# EAGLE design Buck_SMPS_Rev2_2022_05_26_A (EAGLE 9.6.1)
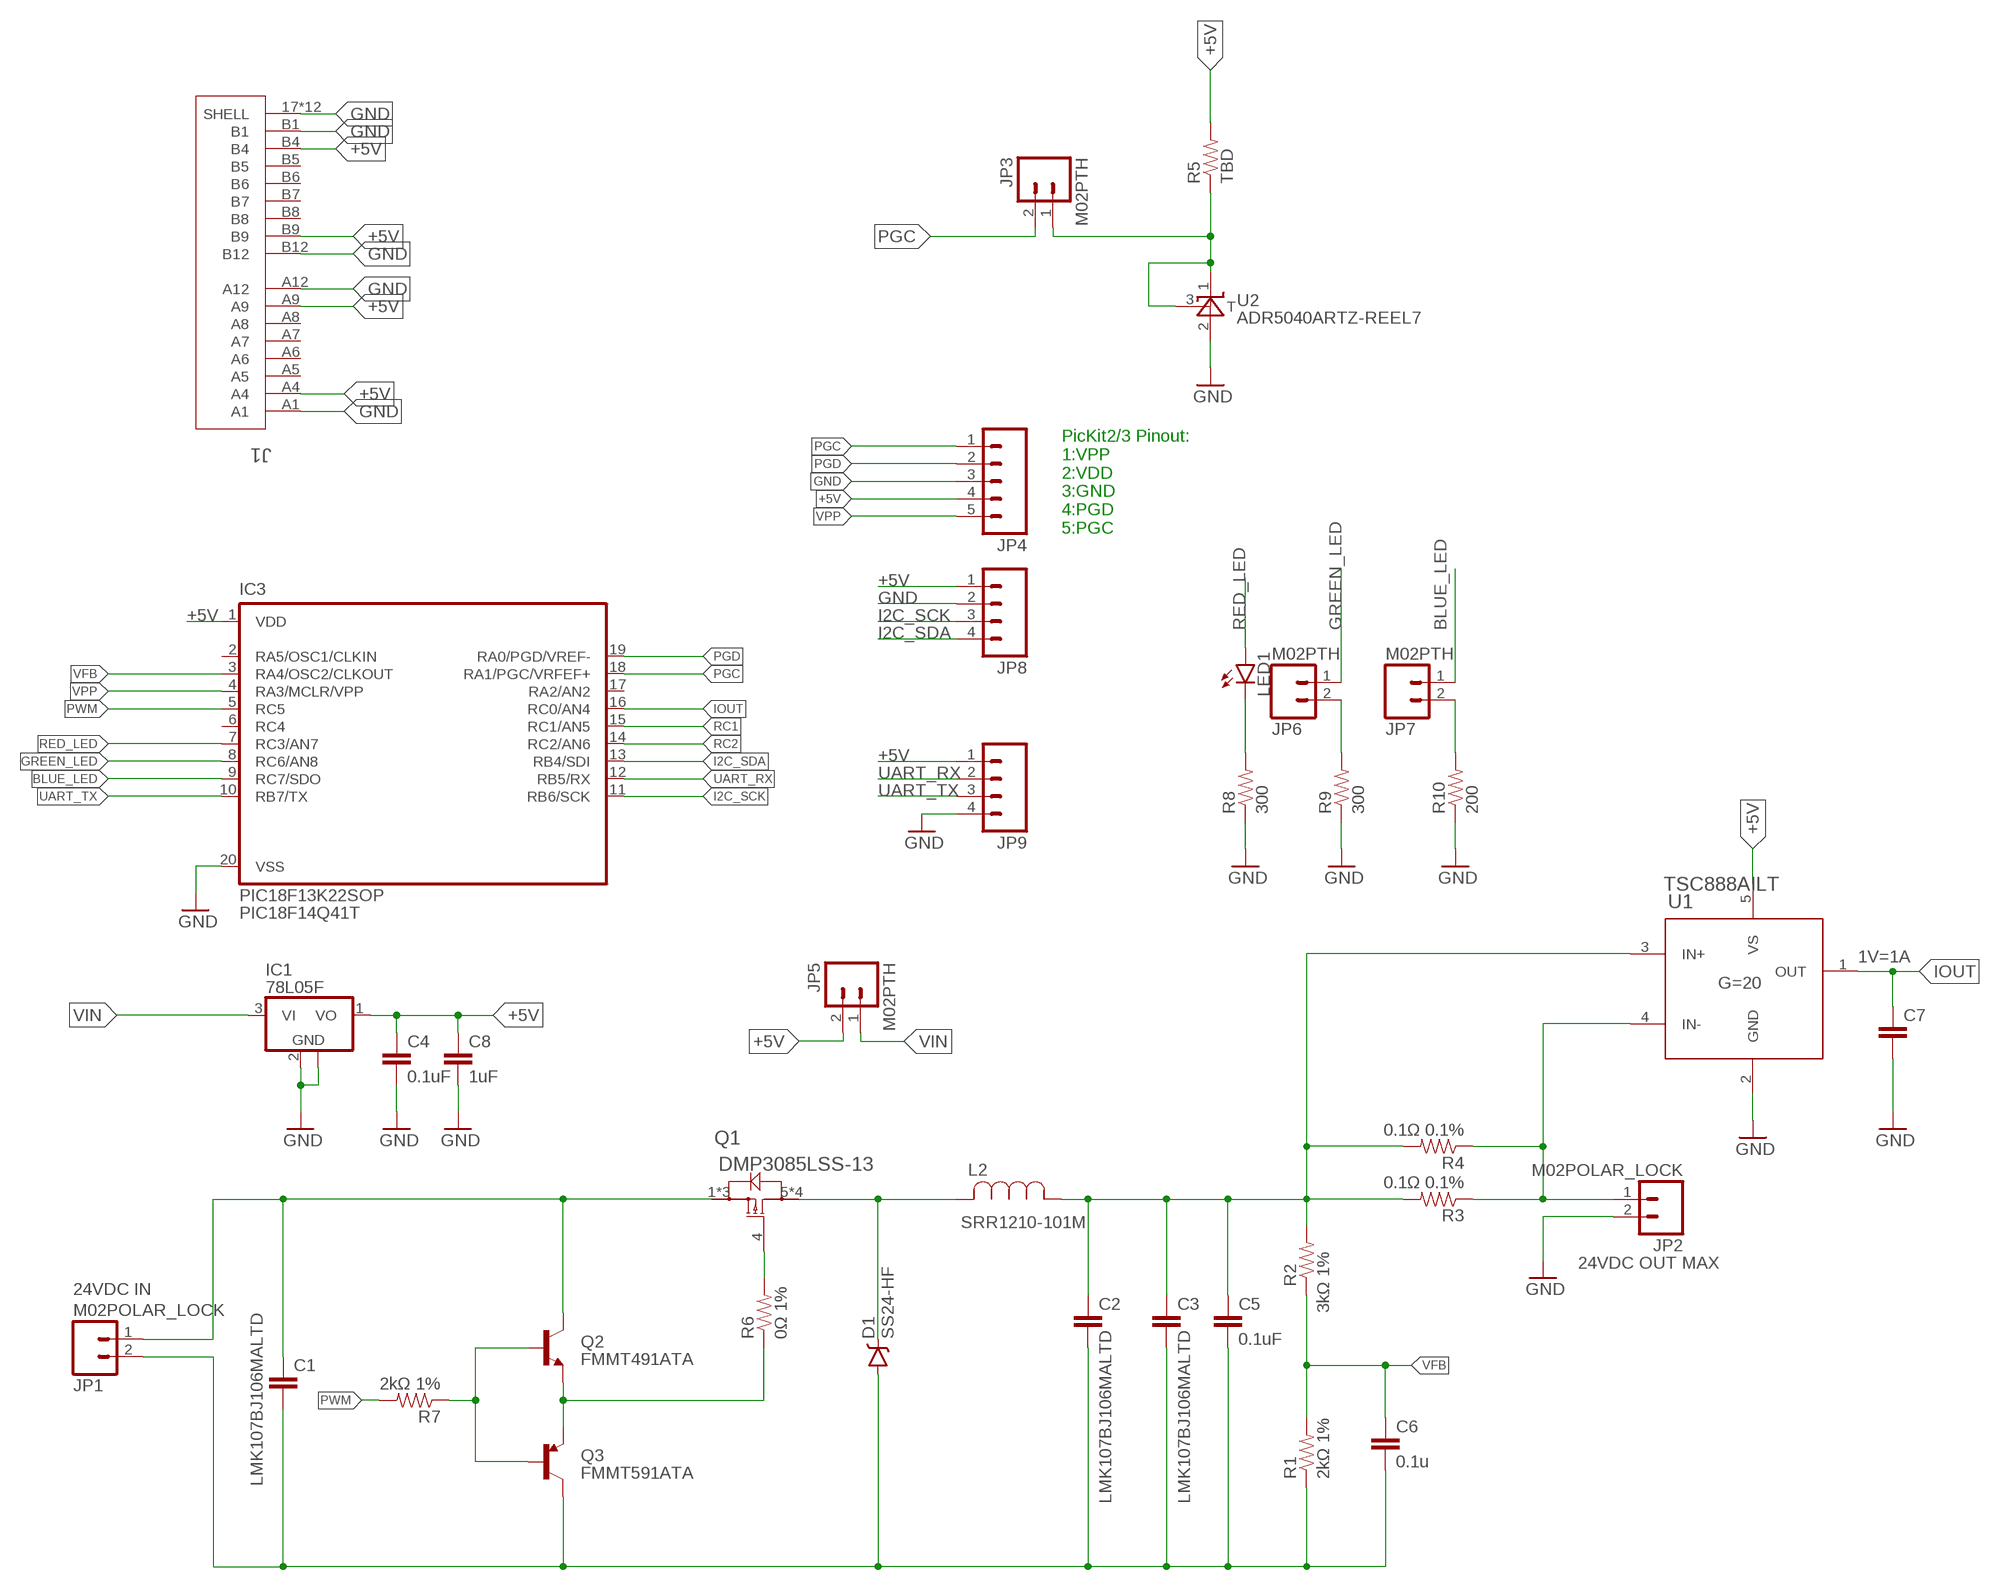
[diagram p0: schematic, sheet 1]

## Parts
C1  LMK107BJ106MALTD  CAP1206  [1206]
C2  LMK107BJ106MALTD  CAP1206  [1206]
C3  LMK107BJ106MALTD  CAP1206  [1206]
C4  0.1uF  CAP1206  [1206]
C5  0.1uF  CAP1206  [1206]
C6  0.1u  CAP0805  [0805]
C7  CAP0805  [0805]
C8  1uF  CAP1206  [1206]
D1  SS24-HF  DIODE-SCHOTTKY-MBRA140  [SMA-DIODE]
IC1  78L05F  [SOT89]
IC3  PIC18F13K22SOP  [SOP20W]
J1  USB4085-GF-A  [CONN16_USB4085-GF-A_GCT]
JP1  M02POLAR_LOCK  [MOLEX-1X2_LOCK]
JP2  M02POLAR_LOCK  [MOLEX-1X2_LOCK]
JP3  M02PTH  [1X02]
JP4  M05PTH_LONGPADS  [1X05_LONGPADS]
JP5  M02PTH  [1X02]
JP6  M02PTH  [1X02]
JP7  M02PTH  [1X02]
JP8  M04LOCK  [1X04_LOCK]
JP9  M04LOCK  [1X04_LOCK]
L2  SRR1210-101M  SRR1210-680M  [IND_BOURNS_SRR1210]
LED1  LED1206  [LED-1206]
Q1  DMP3085LSS-13  DMP3085LSS-13IC_DMP3085LSS-13_DIO-M  [IC_DMP3085LSS-13_DIO-M]
Q2  FMMT491ATA  TRANSISTOR_NPNMMBT5088  [SOT23]
Q3  FMMT591ATA  TRANSISTOR_PNPMMBT4403  [SOT23]
R1  2kΩ 1%  RESISTOR1206  [1206]
R2  3kΩ 1%  RESISTOR1206  [1206]
R3  0.1Ω 0.1%  RESISTOR1206  [1206]
R4  0.1Ω 0.1%  RESISTOR1206  [1206]
R5  TBD  RESISTOR1206  [1206]
R6  0Ω 1%  RESISTOR1206  [1206]
R7  2kΩ 1%  RESISTOR1206  [1206]
R8  300  RESISTOR1206  [1206]
R9  300  RESISTOR1206  [1206]
R10  200  RESISTOR1206  [1206]
U1  TSC888AILT  INA180A1IDBVR  [DBV0005A_N]
U2  ADR5040ARTZ-REEL7  [RT_3_ADI]

## Nets
+5V: C4.1 C8.1 IC1.1(VO) IC3.1(VDD) J1.A4 J1.A9 J1.B4 J1.B9 JP4.4 JP5.2 JP8.1 JP9.1 R5.2 U1.5(VS)
BLUE_LED: IC3.9(RC7/SDO) JP7.1
GND: C1.2 C2.2 C3.2 C4.2 C5.2 C6.2 C7.2 C8.2 D1.A IC1.2(GND) IC1.2@1(GND) IC3.20(VSS) J1.17(SHELL) J1.18(SHELL) J1.19(SHELL) J1.20(SHELL) J1.21(SHELL) J1.22(SHELL) J1.23(SHELL) J1.24(SHELL) J1.25(SHELL) J1.26(SHELL) J1.27(SHELL) J1.28(SHELL) J1.A1 J1.A12 J1.B1 J1.B12 JP1.2 JP2.2 JP4.3 JP8.2 JP9.4 Q3.3(C) R1.1 R8.1 R9.1 R10.1 U1.2(GND) U2.2(A)
GREEN_LED: IC3.8(RC6/AN8) JP6.1
I2C_SCK: IC3.11(RB6/SCK) JP8.3
I2C_SDA: IC3.13(RB4/SDI) JP8.4
IOUT: C7.1 IC3.16(RC0/AN4) U1.1(OUT)
N$3: LED1.C R8.2
N$5: Q2.2(E) Q3.2(E) R6.1
N$6: JP6.2 R9.2
N$7: JP7.2 R10.2
N$8: Q1.4(G) R6.2
N$9: Q2.1(B) Q3.1(B) R7.1
PGC: IC3.18(RA1/PGC/VRFEF+) JP3.2 JP4.1
PGD: IC3.19(RA0/PGD/VREF-) JP4.2
PWM: IC3.5(RC5) R7.2
RC1: IC3.15(RC1/AN5)
RC2: IC3.14(RC2/AN6)
RED_LED: IC3.7(RC3/AN7) LED1.A
SW: D1.C L2.2 Q1.5(D) Q1.6(D) Q1.7(D) Q1.8(D)
UART_RX: IC3.12(RB5/RX) JP9.2
UART_TX: IC3.10(RB7/TX) JP9.3
VFB: C6.1 IC3.3(RA4/OSC2/CLKOUT) R1.2 R2.1
VIN: C1.1 IC1.3(VI) JP1.1 JP5.1 Q1.1(S) Q1.2(S) Q1.3(S) Q2.3(C)
VOUT: C2.1 C3.1 C5.1 L2.1 R2.2 R3.2 R4.2 U1.3(IN+)
VOUT+: JP2.1 R3.1 R4.1 U1.4(IN-)
VPP: IC3.4(RA3/MCLR/VPP) JP4.5
VREF+: JP3.1 R5.1 U2.1(C) U2.3(T)
Unconnected: IC3.2(RA5/OSC1/CLKIN) IC3.6(RC4) IC3.17(RA2/AN2) J1.A5 J1.A6 J1.A7 J1.A8 J1.B5 J1.B6 J1.B7 J1.B8

## Notes on the sheet
- PicKit2/3 Pinout:
  1:VPP
  2:VDD
  3:GND
  4:PGD
  5:PGC
- PIC18F14Q41T
- 1V=1A
- G=20
- 24VDC OUT MAX
- 24VDC IN

## Library data of the parts
C1-C8 = SparkFun-Capacitors:CAP: Capacitor Standard 0603 ceramic capacitor, and 0.1" leaded capacitor.
D1 = SparkFun-DiscreteSemi:DIODE-SCHOTTKY: Schottky diodes in SFE's production catalog BAT20J 1A 23V 0.62Vf RB751 120mA 40V 0.37Vf PMEG4005EJ 0.5A 40V 0.42Vf MBRA140 1A 40V 0.5Vf B340A 3A 40V SMA; PROD_ID: DIO-08053; VALUE: MBRA140
IC1 = linear:78L*: POSITOIV-VOLTAGE REGULATORS Output up to 100 mA Source: Datasheet <http://focus.ti.com/lit/ds/symlink/ua78l05.pdf>
IC3 = PIC18F13k22:PIC18F13K22?: 18/20/28-Pin High-Performance, Enhanced Flash Microcontrollers with 10-bit A/D and nanoWatt Technology Source: ww1.microchip.com/downloads/en/DeviceDoc/39605c.pdf
J1 = USB4085-GF-A_USB_C:USB4085-GF-A; COPYRIGHT: Copyright (C) 2022 Ultra Librarian. All rights reserved.; DIGI-KEY_PART_NUMBER_1: 2073-USB4085-GF-ACT-ND; DIGI-KEY_PART_NUMBER_2: 2073-USB4085-GF-ADKR-ND; DIGI-KEY_PART_NUMBER_3: 2073-USB4085-GF-ATR-ND; MANUFACTURER_PART_NUMBER: USB4085-GF-A; MFR_NAME: Global Connector Technology
JP1-JP3 JP5-JP7 = SparkFun-Connectors:M02: Standard 2-pin 0.1" header. Use with - straight break away headers ( PRT-00116) - right angle break away headers (PRT-00553) - swiss pins (PRT-00743) - machine pins (PRT-00117) - female headers (PRT-00115) Molex polarized connector foot print use with: PRT-08233 with associated crimp pins and housings. 2.54_SCREWTERM for use with PRT-10571. 3.5mm Screw Terminal footprints for PRT-08084 5mm Screw Terminal footprints for use with PRT-08432
JP4 = SparkFun-Connectors:M05: Header 5 Standard 5-pin 0.1" header. Use with straight break away headers (SKU : PRT-00116), right angle break away headers (PRT-00553), swiss pins (PRT-00743), machine pins (PRT-00117), and female headers (PRT-00115). Molex polarized connector foot print use with SKU : PRT-08230 with associated crimp pins and housings.
JP8 JP9 = SparkFun-Connectors:M04: Header 4 Standard 4-pin 0.1" header. Use with straight break away headers (SKU : PRT-00116), right angle break away headers (PRT-00553), swiss pins (PRT-00743), machine pins (PRT-00117), and female headers (PRT-00115). Molex polarized connector foot print use with SKU : PRT-08231 with associated crimp pins and housings. 1MM SMD Version SKU: PRT-10208
L2 = SRR1210_XXX:SRR1210-680M; MANUFACTURER_PART_NUMBER: SRR1210680M; VENDOR: Bourns Electronics
LED1 = SparkFun-LED:LED: LEDs Standard schematic elements and footprints for 5mm, 3mm, 1206, and 0603 sized LEDs. 5mm - Spark Fun Electronics SKU : COM-00529 (and others)
Q1 = DMP3085LSS-13:DMP3085LSS-13; COPYRIGHT: Copyright (C) 2021 Ultra Librarian. All rights reserved.; DIGI-KEY_PART_NUMBER_1: DMP3085LSS-13DITR-ND; DIGI-KEY_PART_NUMBER_2: DMP3085LSS-13DICT-ND; DIGI-KEY_PART_NUMBER_3: DMP3085LSS-13DIDKR-ND; MANUFACTURER_PART_NUMBER: DMP3085LSS-13; MFR_NAME: Diodes Inc
Q2 = SparkFun-DiscreteSemi:TRANSISTOR_NPN: Generic NPN BJT MMBT2222A - TRANS-08049 (SOT-23, 1A 40V) MPSA42 - TRANS-09116 (SOT-23, 500mA 300V) MMBT5088LT1G - TRANS-11160 (SOT-23, 50 mA 30V) BC547 - COM-08928 <http://www.sparkfun.com/products/8928> (TO-92 45V 100mA) (1.Collector 2.Base 3.Emitter) 2N3904 - COM-00521 <http://www.sparkfun.com/products/521> (TO-92 40V 200mA) (1.Emitter 2.Base 3.Collector) P2N2222A - COM-12852 <http://www.sparkfun.com/products/12852> (TO-92 40V 600mA) (1.Collector 2.Base 3.Emitter); PROD_ID: TRANS-11160; VALUE: MMBT5088
Q3 = SparkFun-DiscreteSemi:TRANSISTOR_PNP: Generic PNP BJT Double check pinouts against datasheets- not all devices are the same! MMBT3906 - 40V 200mA SOT-23 (TRANS-08052) MMBT4403 - 40V 600mA SOT-23 (TRANS-09245); PROD_ID: TRANS-09245; VALUE: MMBT4403
R1-R10 = SparkFun-Passives:RESISTOR: Resistor Basic schematic elements and footprints for 0603, 1206, and PTH resistors.
U1 = INA180A1IDBVR:INA180A1IDBVR; MANUFACTURER: Texas Instruments; PARTNUMBER: INA180A1IDBVR; REFDES: RefDes; TYPE: TYPE; VALUE: Value
U2 = ADR5040ARTZ:ADR5040ARTZ-REEL7; BUILT_BY: EMA_UL_Team; MANUFACTURER_PART_NUMBER: ADR5040ARTZ-REEL7; SOURCELIBRARY: Analog_2015-01-06; VENDOR: Analog Devices Inc

## Board
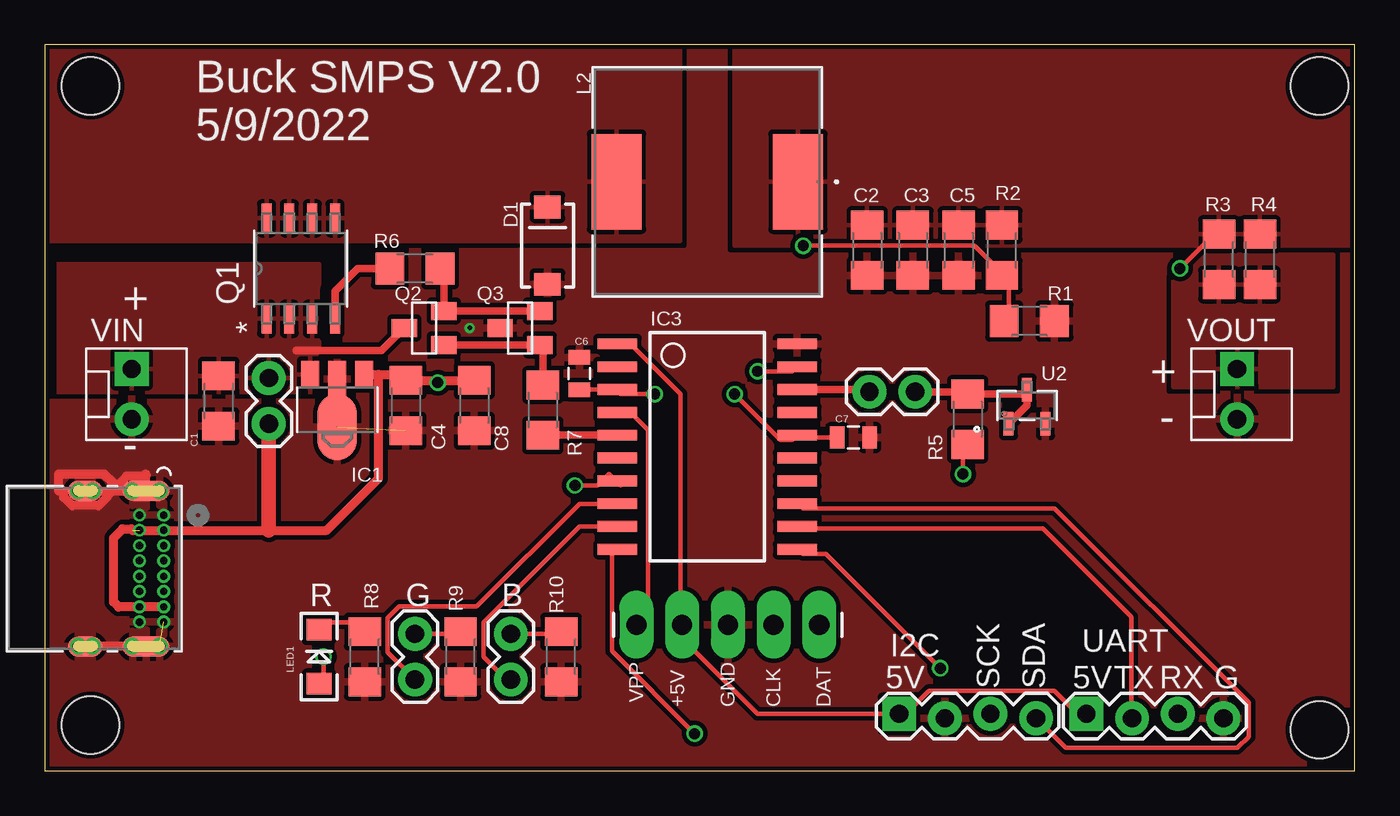
[diagram p1: board, top side]
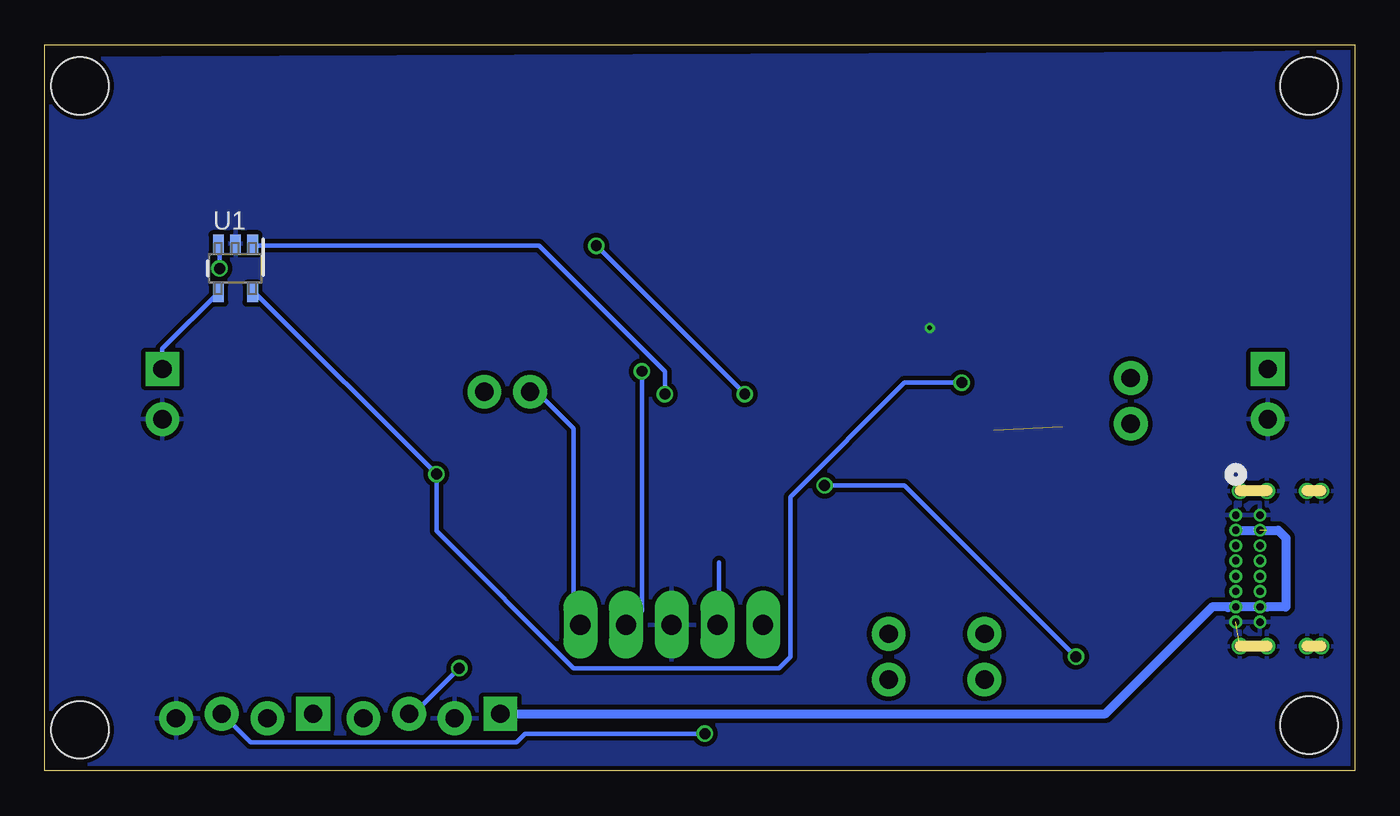
[diagram p2: board, bottom side, seen from below]

Size 72.82 x 40.38 mm. Coordinates in mm from the lower left corner, seen from the top.
Outline: 0,0 72.82,0 72.82,40.38 0,40.38 0,0
Copper layers (1*16): Top 0.035mm / dielectric 1.5mm / Bottom 0.035mm
Design rules "default": minimum track width 5mil, minimum drill 5mil, track to track 10mil, track to pad 10mil, pad to pad 10mil, via to via 10mil, smd to smd 6mil, copper to edge 10mil, drill to drill 6mil, minimum pad ring 6mil, minimum via ring 6mil, stop-mask expansion 4mil, vias tented up to drill 0mil, thermal gap 10mil
Holes 3.2 mm at 2.54,38.1 2.54,2.54 70.87,2.29 70.87,38.1

### Footprints (pad centres in the part's own frame; a part is rotated, then mirrored left to right if it is on the bottom)
1206 = smd 1.6 x 1.8: 1 -1.4,0; 2 1.4,0
0805 = smd 0.8 x 1.2: 1 -0.9,0; 2 0.9,0
SMA-DIODE = smd 1.27 x 1.47: A -2.15,0; C 2.15,0
SOT89 = smd 1 x 1.5: 1 -1.499,-1.981; 3 1.499,-1.981 | smd 1 x 2: 2 0,-1.727 | smd 2.2 x 3.7: 2@1 0,0.94
SOP20W = smd 0.6 x 2.2: 1 -5.715,-5; 2 -4.445,-5; 3 -3.175,-5; 4 -1.905,-5; 5 -0.635,-5; 6 0.635,-5; 7 1.905,-5; 8 3.175,-5; 9 4.445,-5; 10 5.715,-5; 11 5.715,5; 12 4.445,5; 13 3.175,5; 14 1.905,5; 15 0.635,5; 16 -0.635,5; 17 -1.905,5; 18 -3.175,5; 19 -4.445,5; 20 -5.715,5
CONN16_USB4085-GF-A_GCT = smd 1.118 x 2.616: 17 -1.35,-0.98; 18 7.3,-0.98 | smd 1.118 x 1.905: 19 -1.35,-4.365; 20 7.3,-4.365 | drill 0.61 pad 0.61: 21 -1.346,-0.229; 22 -1.346,-1.727; 23 7.29,-0.229; 24 7.29,-1.727; 25 -1.346,-3.962; 26 -1.346,-4.75; 27 7.29,-3.962; 28 7.29,-4.75 | drill 0.406 pad 0.66: A1 0,0; A4 0.838,0; A5 1.702,0; A6 2.54,0; A7 3.404,0; A8 4.242,0; A9 5.105,0; A12 5.944,0; B1 5.944,-1.346; B4 5.105,-1.346; B5 4.242,-1.346; B6 3.404,-1.346; B7 2.54,-1.346; B8 1.702,-1.346; B9 0.838,-1.346; B12 0,-1.346
MOLEX-1X2_LOCK = drill 1.016 pad 1.88 square: 1 -0.127,0 | drill 1.016 pad 1.88: 2 2.667,0
1X02 = drill 1.016 pad 1.88: 1 0,0; 2 2.54,0
1X05_LONGPADS = drill 1.118 pad 1.88 long: 1 0,0; 2 2.54,0; 3 5.08,0; 4 7.62,0; 5 10.16,0
1X04_LOCK = drill 1.016 pad 1.88 square: 1 0,0.127 | drill 1.016 pad 1.88: 2 2.54,-0.127; 3 5.08,0.127; 4 7.62,-0.127
IND_BOURNS_SRR1210 = smd 2.794 x 5.309: 1 -5.042,0; 2 5.042,0
LED-1206 = smd 1.2 x 1.4: A -1.5,0; C 1.5,0
IC_DMP3085LSS-13_DIO-M = smd 1.628 x 0.559: 1 -2.795,1.905; 2 -2.795,0.635; 3 -2.795,-0.635; 4 -2.795,-1.905; 5 2.795,-1.905; 6 2.795,-0.635; 7 2.795,0.635; 8 2.795,1.905
SOT23 = smd 1 x 1.4: 1 -0.95,-1.1; 2 0.95,-1.1; 3 0,1.1
DBV0005A_N = smd 1 x 0.6: 1 -1.375,0.95; 2 -1.375,0; 3 -1.375,-0.95; 4 1.375,-0.95; 5 1.375,0.95
RT_3_ADI = smd 0.559 x 1.321: 1 -1.025,-1.016; 2 1.025,-1.016; 3 0,0.883

### Placement (x,y rotation side)
C1  9.65,20.57 270 top
C2  45.72,28.96 270 top
C3  48.26,28.96 270 top
C4  20.07,20.32 270 top
C5  50.8,28.96 270 top
C6  29.72,22.1 90 top
C7  44.96,18.54 0 top
C8  23.88,20.32 270 top
D1  27.94,29.21 90 top
IC1  16.26,20.07 180 top
IC3  36.83,18.03 270 top
J1  6.6,14.22 270 top
JP1  4.83,22.23 270 top
JP2  66.29,22.23 270 top
JP3  48.39,21.08 180 top
JP4  43.05,8.13 180 top
JP5  12.45,21.84 270 top
JP6  20.57,5.08 90 top
JP7  25.91,5.08 90 top
JP8  47.5,3.05 0 top
JP9  57.91,3.05 0 top
L2  36.83,32.77 180 top
LED1  15.24,6.35 90 top
Q1  14.22,27.94 90 top
Q2  21.08,24.64 90 top
Q3  26.42,24.64 90 top
R1  54.74,25.02 180 top
R2  53.21,28.96 90 top
R3  65.28,28.45 90 top
R4  67.56,28.45 90 top
R5  51.31,19.56 270 top
R6  20.57,27.94 180 top
R7  27.69,20.07 270 top
R8  17.78,6.35 90 top
R9  23.11,6.35 90 top
R10  28.7,6.35 90 top
U1  62.23,27.94 270 bottom
U2  54.61,20.32 0 top

### Tracks (layer width: path | path; a pad name or v marks a point on that pad's centre or on a via)
+5V  (via drill 0.61)  (1 unrouted)
  Top 0.254: IC3.1 31.84,23.65 32.64,23.65 35.34,20.95 35.34,8.26 JP4.4 35.18,7.62 39.62,3.17 JP8.1 47.88,3.17 49.15,4.44 56.13,4.44 57.4,3.17 JP9.1 | 20.04,21.84 C4.1 20.16,21.7 20.57,21.59 v21.84,21.59 | v51.05,16.51 51.05,17.78 R5.2
  Top 0.508: J1.B9 J1.A4 12.45,13.39 15.67,13.39 18.54,16.26 18.54,22.05 | C8.1 23.85,21.7 20.16,21.7 | IC1.1 18.54,22.05 | 18.54,22.05 19.83,22.05 20.04,21.84 | 4.89,13.37 4.8,13.46 4.32,13.46 3.81,12.95 3.81,9.4 4.09,9.12 J1.B4 J1.A9
  Top 0.813: JP5.2 12.45,13.39
  Bottom 0.254: 35.34,11.59 35.34,8.26 JP4.4 | U1.5 61.21,26.67 v51.05,16.51 51.05,13.33 43.43,5.71 32,5.71 31.37,6.35 31.37,15.24 25.02,21.59 v21.84,21.59
  Bottom 0.508: JP8.1 13.84,3.17 7.87,9.14 6.99,9.14 6.97,9.13 6.99,9.12 | J1.A4 4.24,13.39 3.81,12.95 3.81,9.14 3.83,9.12 4.88,9.12 | J1.B4 6.99,9.12 | 6.99,9.12 7.04,9.07
BLUE_LED
  Top 0.254: IC3.9 29.72,13.59 24.38,8.26 24.38,6.35 25.65,5.08 JP7.1
GND  (via drill 0.25 pad 0.2)  (9 unrouted)
  Top 0.508: J1.19 3.81,15.57 | 3.81,15.57 J1.21 | J1.17 5.59,15.61 5.59,16.51 5.62,16.47 5.62,16.38 4.54,16.38 3.45,15.3 3.45,15.23 2.98,14.76 1.52,14.76 1.04,15.23 1.04,15.57 0.76,15.57 0.76,16.51 3.3,16.51 3.81,16 3.81,15.57 | J1.18 J1.28
  other vias: 23.62,24.64
  pour Top (isolate 0.254, rank 2): -17.27,42.64 75.18,42.93 75.18,-1.27 -17.27,-1.56
  pour Bottom: 7.37,39.88 72.9,39.62 72.9,-3.3 -8.38,-2.79 -8.38,40.13
GREEN_LED
  Top 0.254: IC3.8 29.72,14.86 24,9.14 19.69,9.14 19.05,8.51 19.05,6.6 JP6.1
I2C_SCK  (via drill 0.61)
  Top 0.254: v49.78,5.71 43.43,12.06 42.16,12.06 IC3.11
  Bottom 0.254: v49.78,5.71 52.32,3.17 JP8.3
I2C_SDA
  Top 0.254: JP8.4 56.77,1.27 66.29,1.27 66.93,1.9 66.93,3.81 56.13,14.6 42.16,14.6 IC3.13
IOUT  (via drill 0.61)
  Top 0.254: 41.85,18.57 IC3.16 | v38.35,20.95 40.89,18.41 41.53,18.41 IC3.16 | IC3.16 41.96,18.54 C7.1
  Bottom 0.254: v38.35,20.95 38.35,22.23 45.34,29.21 61.21,29.21 U1.1
N$3
  Top 0.254: 17.65,7.62 R8.2 17.4,8.26 15.49,8.26 LED1.C
N$5
  Top 0.406: Q2.2 22.18,25.65 | 22.18,25.65 22.18,27.73 R6.1 | Q3.2 22.25,25.59 22.18,25.65
N$6
  Top 0.254: 22.99,7.87 R9.2 22.98,7.62 JP6.2
N$7
  Top 0.254: JP7.2 28.57,7.62 R10.2
N$8
  Top 0.406: Q1.4 16.13,26.67 17.4,27.94 R6.2
N$9
  Top 0.406: Q2.1 Q3.1 27.69,23.52 R7.1
PGC
  Top 0.406: IC3.18 45.72,21.21 JP3.2
  Bottom 0.254: JP4.1 43.43,8.26 43.43,19.05 45.34,20.95 JP3.2
PGD  (via drill 0.61)
  Top 0.254: 41.05,22.38 41.69,22.38 IC3.19 41.53,22.23 v39.62,22.23
  Bottom 0.254: v39.62,22.23 39.62,8.89 40.26,8.26 JP4.2
PWM
  Top 0.406: IC3.5 R7.2
RC1
  Top 0.254: 41.85,17.3 IC3.15
RC2
  Top 0.254: 41.85,16.03 IC3.14
RED_LED  (via drill 0.61)
  Top 0.254: v15.49,6.35 15.49,5.08 LED1.A | v29.46,15.87 30.73,15.87 31.37,16.51 32,15.87 IC3.7
  Bottom 0.254: v15.49,6.35 25.02,15.87 v29.46,15.87
SW
  pour Top (isolate 0.254): -4.32,41.91 35.31,41.91 35.31,29.46 -4.32,29.46
UART_RX
  Top 0.254: IC3.12 41.85,13.49 55.5,13.49 60.42,8.57 60.42,3.02 JP9.2
UART_TX  (via drill 0.61)
  Top 0.254: v36.13,2.06 31.53,6.67 31.53,12.12 IC3.10
  Bottom 0.254: v36.13,2.06 46.13,2.06 46.61,1.59 61.37,1.59 62.96,3.17 JP9.3
VFB  (via drill 0.61)
  Top 0.254: R1.2 53.59,25.4 53.59,27.3 R2.1 52.96,27.94 51.69,29.21 v42.16,29.21 42.05,29.21 | v33.91,20.95 32,20.95 IC3.3 31.69,21.27 31.61,21.2 C6.1
  Bottom 0.254: v42.16,29.21 v33.91,20.95
VIN
  Top 0.406: Q2.3 18.71,23.37 13.97,23.37
  pour Top (isolate 0.635): -4.32,21.08 15.24,21.08 15.24,28.19 -4.32,28.19
VOUT  (via drill 0.61)
  Top 0.254: v63.12,27.94 65.02,29.84 R3.2
  Bottom 0.254: v63.12,27.94 63.12,29.21 U1.3
  pour Top (isolate 0.254): 38.35,41.66 73.41,41.66 73.41,29.21 38.35,29.21
VOUT+
  Bottom 0.254: JP2.1 66.29,23.49 63.12,26.67 U1.4
  pour Top: 62.74,21.34 71.63,21.34 71.63,28.7 62.74,28.7
VPP
  Top 0.254: IC3.4 31.84,19.84 32.64,19.84 33.53,18.95 33.53,8.83 32.96,8.26 JP4.5
VREF+
  Top 0.406: JP3.1 51.18,21.08 R5.1 54.37,20.96 U2.3 54.61,20.33 U2.1

### Text on the board
tNames: Buck SMPS V2.0 / 5/9/2022 | + | VIN | VOUT | + | - | - | R | G | B | I2C | UART | 5V | SCK | SDA | 5V | TX | RX | G | VPP | +5V | GND | CLK | DAT